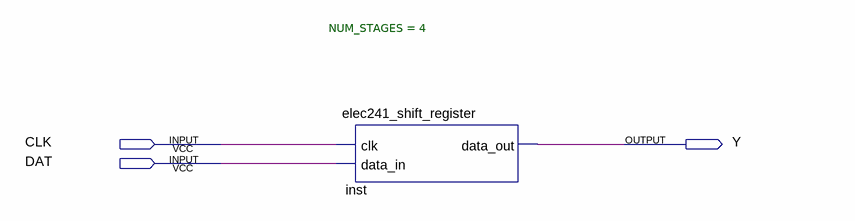
[diagram p0: schematic sheet]
// Quartus schematic top_level.bdf as structural Verilog: 1 symbols, 3 pins
module top_level (
  input  CLK,
  input  DAT,
  output Y
);

  elec241_shift_register #(.NUM_STAGES(4)) inst (.clk(CLK), .data_in(DAT), .data_out(Y));
endmodule
